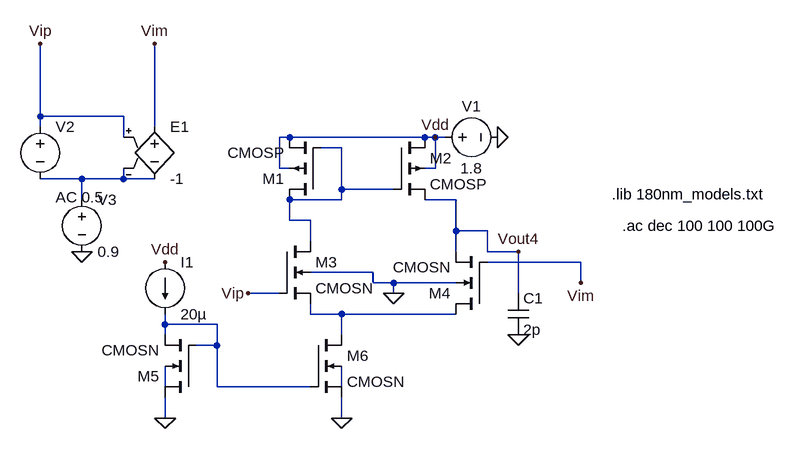
[diagram p0: schematic Phase(Differential).asc]
Phase(Differential).asc, the LTspice schematic file:
Version 4
SHEET 1 880 680
WIRE -272 -32 -272 -144
WIRE -144 -32 -272 -32
WIRE -272 -16 -272 -32
WIRE -96 -16 -96 -144
WIRE -144 0 -144 -32
WIRE 112 0 96 0
WIRE 320 0 112 0
WIRE 336 0 320 0
WIRE 352 0 336 0
WIRE 192 16 160 16
WIRE 96 48 96 0
WIRE 112 48 96 48
WIRE 336 48 336 0
WIRE 336 48 320 48
WIRE -208 64 -272 64
WIRE -144 64 -144 48
WIRE -144 64 -208 64
WIRE -96 64 -144 64
WIRE 192 80 192 16
WIRE 272 80 192 80
WIRE -208 96 -208 64
WIRE 192 96 192 80
WIRE 192 96 112 96
WIRE 368 96 320 96
WIRE 112 128 112 96
WIRE 144 128 112 128
WIRE 368 144 368 96
WIRE 416 144 368 144
WIRE 144 160 144 128
WIRE 368 176 368 144
WIRE 416 176 416 144
WIRE 464 176 416 176
WIRE 560 192 416 192
WIRE 240 208 144 208
WIRE 240 224 240 208
WIRE 272 224 240 224
WIRE 368 224 272 224
WIRE 560 224 560 192
WIRE 96 240 48 240
WIRE 272 240 272 224
WIRE 464 240 464 176
WIRE 144 272 144 256
WIRE 192 272 144 272
WIRE 368 272 192 272
WIRE -80 288 -80 272
WIRE 0 288 -80 288
WIRE -80 304 -80 288
WIRE 192 304 192 272
WIRE 0 320 0 288
WIRE 0 320 -32 320
WIRE -80 384 -80 352
WIRE 0 384 0 320
WIRE 144 384 0 384
WIRE 192 384 192 352
WIRE -80 432 -80 400
WIRE 192 432 192 400
FLAG 432 0 0
FLAG 272 240 0
FLAG -80 432 0
FLAG 192 432 0
FLAG 336 0 Vdd
FLAG -80 192 Vdd
FLAG 48 240 Vip
FLAG -208 176 0
FLAG -272 -144 Vip
FLAG -96 -144 Vim
FLAG 464 176 Vout4
FLAG 464 304 0
FLAG 560 224 Vim
SYMBOL pmos4 160 96 R180
SYMATTR InstName M1
SYMATTR Value CMOSP
SYMATTR Value2 l=0.6u w=60u
SYMBOL pmos4 272 0 R0
SYMATTR InstName M2
SYMATTR Value CMOSP
SYMATTR Value2 l=0.6u w=60u
SYMBOL nmos4 96 160 R0
SYMATTR InstName M3
SYMATTR Value CMOSN
SYMATTR Value2 l=5u w=60u
SYMBOL nmos4 416 272 R180
SYMATTR InstName M4
SYMATTR Value CMOSN
SYMATTR Value2 l=5u w=60u
SYMBOL voltage 336 0 R270
WINDOW 0 32 56 VTop 2
WINDOW 3 -32 56 VBottom 2
WINDOW 123 0 0 Left 0
WINDOW 39 0 0 Left 0
SYMATTR InstName V1
SYMATTR Value 1.8
SYMBOL nmos4 -32 400 R180
SYMATTR InstName M5
SYMATTR Value CMOSN
SYMATTR Value2 l=5u w=50u
SYMBOL nmos4 144 304 R0
SYMATTR InstName M6
SYMATTR Value CMOSN
SYMATTR Value2 l=5u w=50u m=10
SYMBOL current -80 192 R0
WINDOW 123 0 0 Left 0
WINDOW 39 0 0 Left 0
SYMATTR InstName I1
SYMATTR Value 20µ
SYMBOL voltage -272 -32 R0
WINDOW 3 24 152 Left 2
WINDOW 123 24 124 Left 2
WINDOW 39 0 0 Left 0
SYMATTR Value ""
SYMATTR Value2 AC 0.5
SYMATTR InstName V2
SYMBOL voltage -208 80 R0
WINDOW 123 0 0 Left 0
WINDOW 39 0 0 Left 0
SYMATTR InstName V3
SYMATTR Value 0.9
SYMBOL e -96 -32 R0
SYMATTR InstName E1
SYMATTR Value -1
SYMBOL cap 448 240 R0
SYMATTR InstName C1
SYMATTR Value 2p
TEXT 608 88 Left 2 !.lib 180nm_models.txt
TEXT 624 136 Left 2 !.ac dec 100 100 100G

The netlist it stands for:
* Phase(Differential).asc
M1 N001 N001 Vdd Vdd CMOSP l=0.6u w=60u
M2 Vdd N001 Vout4 Vdd CMOSP l=0.6u w=60u
M3 N001 Vip N003 0 CMOSN l=5u w=60u
M4 N003 Vim Vout4 0 CMOSN l=5u w=60u
V1 Vdd 0 1.8
M5 0 N004 N004 N005 CMOSN l=5u w=50u
M6 N003 N004 0 N006 CMOSN l=5u w=50u m=10
I1 Vdd N004 20µ
V2 Vip N002 AC 0.5
V3 N002 0 0.9
E1 Vim N002 Vip N002 -1
C1 Vout4 0 2p
.model NMOS NMOS
.model PMOS PMOS
.lib standard.mos
.lib 180nm_models.txt
.ac dec 100 100 100G
.backanno
.end